# Altium schematic sheet QCopterFC_KEY_Sch.SchDoc
size A4
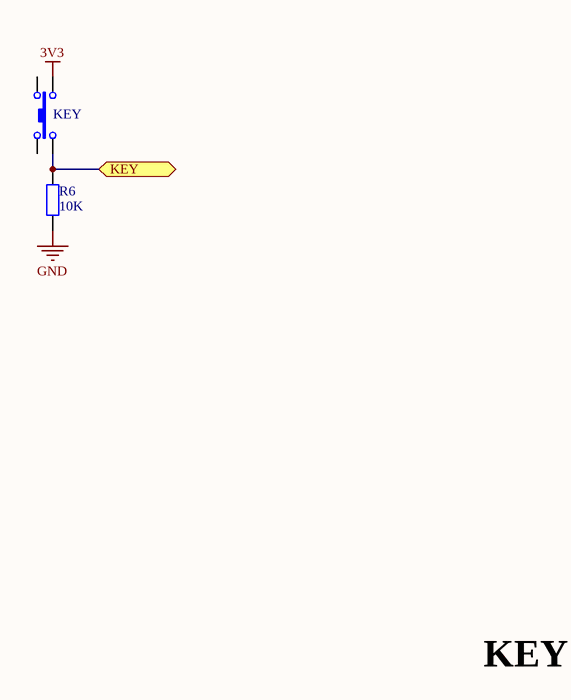
[diagram p0: QCopterFC_KEY_Sch.SchDoc]

## Parts
KEY  BT_TACT_4.2x6.4_90  [BT_TACT_4.2x6.4_90]  (value not drawn)
R6  value 10K  [RES_0603]  (hidden comment: Res_0603)

## Ports
KEY

## Nets
3V3: KEY.4
GND: R6.1
KEY: KEY.3 R6.2 ; port KEY

Not connected (* = marked no-connect by the designer): KEY 1 2

## Notes on the sheet
- KEY

## Library data of the parts
KEY = BT_TACT_4.2x6.4_90: Switch
R6 = Res_0603: Resistor